# EAGLE design dual_encoder_i2c_revC (EAGLE 8.6.0)
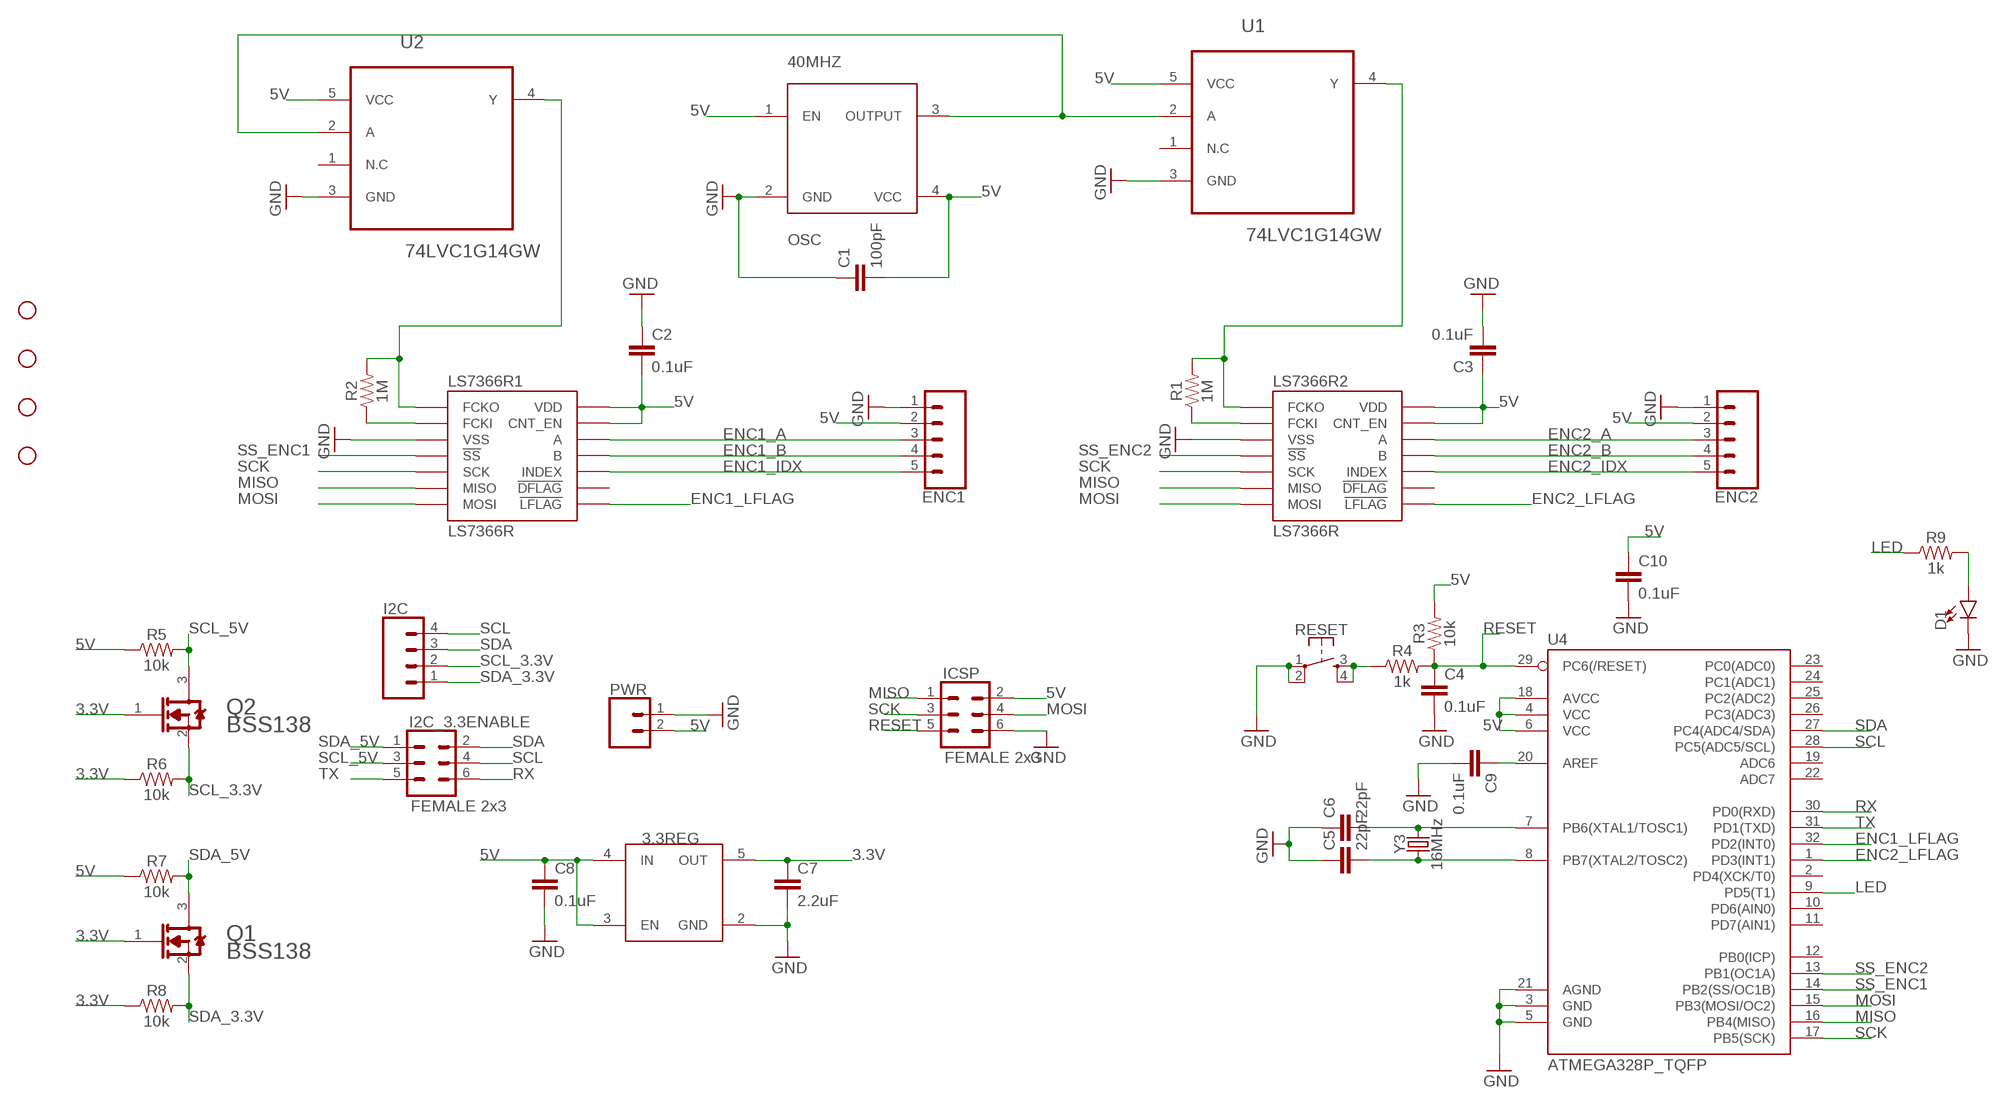
[diagram p0: schematic, sheet 1]

## Parts
3.3REG  MIC3490-3.3YM5-TR  [SOT95P285X145-5N]
40MHZ  OSC  [CB3OSCILLATOR]
C1  100pF  100PF-0603-50V-5%  [0603]
C2  0.1uF  0.1UF-0603-25V-5%  [0603]
C3  0.1uF  0.1UF-0603-25V-5%  [0603]
C4  0.1uF  0.1UF-0603-25V-5%  [0603]
C5  22pF  22PF-0603-50V-5%  [0603]
C6  22pF  22PF-0603-50V-5%  [0603]
C7  2.2uF  2.2UF-0603-10V-20%  [0603]
C8  0.1uF  0.1UF-0603-25V-5%  [0603]
C9  0.1uF  0.1UF-0603-25V-5%  [0603]
C10  0.1uF  0.1UF-0603-25V-5%  [0603]
D1  LED0603  [LED-0603]
ENC1  CONN_05  [1X05]
ENC2  CONN_05  [1X05]
H1  STAND-OFF  [STAND-OFF]
H2  STAND-OFF  [STAND-OFF]
H3  STAND-OFF  [STAND-OFF]
H4  STAND-OFF  [STAND-OFF]
I2C  CONN_04  [1X04]
I2C_3.3ENABLE  FEMALE 2x3  CONN_03X2FEMALE  [2X3]
ICSP  FEMALE 2x3  CONN_03X2FEMALE  [2X3]
LS7366R1  LS7366R  [SOIC14]
LS7366R2  LS7366R  [SOIC14]
PWR  CONN_02-JST-2MM-SMT  [JST-2-SMD]
Q1  ON_SEMI_BSS138ON_SEMI_BSS138_0_0  [ON_SEMI_BSS138_0]
Q2  ON_SEMI_BSS138ON_SEMI_BSS138_0_0  [ON_SEMI_BSS138_0]
R1  1M  1MOHM-0603-1/4W-5%  [0603]
R2  1M  1MOHM-0603-1/4W-5%  [0603]
R3  10k  10KOHM-0603-1/10W-1%  [0603]
R4  1k  1KOHM-0603-1/10W-1%  [0603]
R5  10k  10KOHM-0603-1/10W-1%  [0603]
R6  10k  10KOHM-0603-1/10W-1%  [0603]
R7  10k  10KOHM-0603-1/10W-1%  [0603]
R8  10k  10KOHM-0603-1/10W-1%  [0603]
R9  1k  1KOHM-0603-1/10W-1%  [0603]
RESET  MOMENTARY-SWITCH-SPST-2-SMD-5.2MM  [TACTILE_SWITCH_SMD_5.2MM]
U1  74LVC1G14GW  [SOT65P210X110-5N]
U2  74LVC1G14GW  [SOT65P210X110-5N]
U4  ATMEGA328P_TQFP  [TQFP32-08]
Y3  16MHz  CRYSTAL-16MHZSMD-5X3.2  [CRYSTAL-SMD-5X3.2-4PAD]

## Nets
3.3V: 3.3REG.5(OUT) C7.1 Q1.1(G) Q2.1(G) R6.1 R8.1
5V: 3.3REG.3(EN) 3.3REG.4(IN) 40MHZ.1(EN) 40MHZ.4(VCC) C1.2 C2.2 C3.1 C8.1 C10.1 ENC1.2 ENC2.2 ICSP.2 LS7366R1.13(CNT_EN) LS7366R1.14(VDD) LS7366R2.13(CNT_EN) LS7366R2.14(VDD) PWR.2 R3.2 R5.1 R7.1 U1.5(VCC) U2.5(VCC) U4.4(VCC) U4.6(VCC) U4.18(AVCC)
ENC1_A: ENC1.3 LS7366R1.12(A)
ENC1_B: ENC1.4 LS7366R1.11(B)
ENC1_IDX: ENC1.5 LS7366R1.10(INDEX)
ENC1_LFLAG: LS7366R1.8(!LFLAG) U4.32(PD2(INT0))
ENC2_A: ENC2.3 LS7366R2.12(A)
ENC2_B: ENC2.4 LS7366R2.11(B)
ENC2_IDX: ENC2.5 LS7366R2.10(INDEX)
ENC2_LFLAG: LS7366R2.8(!LFLAG) U4.1(PD3(INT1))
GND: 3.3REG.2(GND) 40MHZ.2(GND) C1.1 C2.1 C3.2 C4.2 C5.1 C6.1 C7.2 C8.2 C9.2 C10.2 D1.C ENC1.1 ENC2.1 ICSP.6 LS7366R1.3(VSS) LS7366R2.3(VSS) PWR.1 RESET.1 RESET.2 U1.3(GND) U2.3(GND) U4.3(GND) U4.5(GND) U4.21(AGND)
LED: R9.1 U4.9(PD5(T1))
MISO: ICSP.1 LS7366R1.6(MISO) LS7366R2.6(MISO) U4.16(PB4(MISO))
MOSI: ICSP.4 LS7366R1.7(MOSI) LS7366R2.7(MOSI) U4.15(PB3(MOSI/OC2))
N$1: C9.1 U4.20(AREF)
N$2: R4.1 RESET.3 RESET.4
N$3: D1.A R9.2
N$6: LS7366R1.2(FCKI) R2.1
N$7: 40MHZ.3(OUTPUT) U1.2(A) U2.2(A)
N$8: LS7366R2.1(FCKO) R1.2 U1.4(Y)
N$9: LS7366R2.2(FCKI) R1.1
N$10: LS7366R1.1(FCKO) R2.2 U2.4(Y)
N$12: C6.2 U4.7(PB6(XTAL1/TOSC1)) Y3.3
N$13: C5.2 U4.8(PB7(XTAL2/TOSC2)) Y3.1
RESET: C4.1 ICSP.5 R3.1 R4.2 U4.29(PC6(/RESET))
RX: I2C_3.3ENABLE.6 U4.30(PD0(RXD))
SCK: ICSP.3 LS7366R1.5(SCK) LS7366R2.5(SCK) U4.17(PB5(SCK))
SCL: I2C.4 I2C_3.3ENABLE.4 U4.28(PC5(ADC5/SCL))
SCL_3.3V: I2C.2 Q2.2(S) R6.2
SCL_5V: I2C_3.3ENABLE.3 Q2.3(D) R5.2
SDA: I2C.3 I2C_3.3ENABLE.2 U4.27(PC4(ADC4/SDA))
SDA_3.3V: I2C.1 Q1.2(S) R8.2
SDA_5V: I2C_3.3ENABLE.1 Q1.3(D) R7.2
SS_ENC1: LS7366R1.4(!SS) U4.14(PB2(SS/OC1B))
SS_ENC2: LS7366R2.4(!SS) U4.13(PB1(OC1A))
TX: I2C_3.3ENABLE.5 U4.31(PD1(TXD))
Unconnected: LS7366R1.9(!DFLAG) LS7366R2.9(!DFLAG) U1.1(N.C) U2.1(N.C) U4.2(PD4(XCK/T0)) U4.10(PD6(AIN0)) U4.11(PD7(AIN1)) U4.12(PB0(ICP)) U4.19(ADC6) U4.22(ADC7) U4.23(PC0(ADC0)) U4.24(PC1(ADC1)) U4.25(PC2(ADC2)) U4.26(PC3(ADC3))

## Library data of the parts
3.3REG = steveo:MIC3490-3.3YM5-TR
40MHZ = steveo:OSC: CB3 40mhz Oscillator smd
C1 = SparkFun-Capacitors:100PF: 100pF/0.1nF ceramic capacitors A capacitor is a passive two-terminal electrical component used to store electrical energy temporarily in an electric field.; PROD_ID: CAP-07883
C2-C4 C8-C10 = SparkFun-Capacitors:0.1UF: 0.1µF ceramic capacitors A capacitor is a passive two-terminal electrical component used to store electrical energy temporarily in an electric field.; PROD_ID: CAP-08604
C5 C6 = SparkFun-Capacitors:22PF: 22pF ceramic capacitors A capacitor is a passive two-terminal electrical component used to store electrical energy temporarily in an electric field.; PROD_ID: CAP-07876
C7 = SparkFun-Capacitors:2.2UF: 2.2µF ceramic capacitors A capacitor is a passive two-terminal electrical component used to store electrical energy temporarily in an electric field.; PROD_ID: CAP-07888
D1 = SparkFun-LED:LED: LED (Generic) Standard schematic elements and footprints for 5mm, 3mm, 1206, and 0603 sized LEDs. Generic LEDs with no color specified.
ENC1 ENC2 = SparkFun-Connectors:CONN_05: Multi connection point. Often used as Generic Header-pin footprint for 0.1 inch spaced/style header connections On any of the 0.1 inch spaced packages, you can populate with these: Break Away Headers - Straight <https://www.sparkfun.com/products/116> (PRT-00116) Break Away Male Headers - Right Angle <https://www.sparkfun.com/products/553> (PRT-00553) Female Headers <https://www.sparkfun.com/products/115> (PRT-00115) Break Away Headers - Machine Pin <https://www.sparkfun.com/products/117> (PRT-00117) Break Away Female Headers - Swiss Machine Pin <https://www.sparkfun.com/products/743> (PRT-00743) For SCREWTERMINALS and SPRING TERMINALS visit here: Screw Terimnals on SparkFun.com <https://www.sparkfun.com/search/results?term=Screw+Terminals> (5mm/3.5mm/2.54mm spacing) This device is also useful as a general connection point to wire up your design to another part of your project. Our various solder wires solder well into these plated through hole pads. Hook-Up Wire - Assortment (Stranded, 22 AWG) <https://www.sparkfun.com/products/11375> (PRT-11375) Hook-Up Wire - Assortment (Solid Core, 22 AWG) <https://www.sparkfun.com/products/11367> (PRT-11367) View the entire wire category on our website here <https://www.sparkfun.com/categories/141> Special notes: Molex polarized connector foot print use with SKU : PRT-08231 with associated crimp pins and housings. 1MM SMD Version SKU: PRT-10208
H1-H4 = SparkFun-Hardware:STAND-OFF: Stand Off Drill holes for mechanically mounting via screws, standoffs, etc. Note: Use the keepout ring to avoid running the screw head into surrounding components. Variant Overviews STAND-OFF - Mechanical footprint for a #4 phillips button head screw. STAND-OFF-TIGHT - Mechanical footprint for a #4 phillips button head screw, Example SparkFun Products Screw - Phillips Head (1/4", 4-40, 10 pack) <https://www.sparkfun.com/products/10453> (PRT-10453) Screw - Phillips Head (1/2", 4-40, 10 pack) <https://www.sparkfun.com/products/10452> (PRT-10452) Screw - Phillips Head (3/4", 4-40, 10 pack) <https://www.sparkfun.com/products/10451> (PRT-10451) Screw - Phillips Head (1", 4-40, 10 pack) <https://www.sparkfun.com/products/10450> (PRT-10450)
I2C = SparkFun-Connectors:CONN_04: Multi connection point. Often used as Generic Header-pin footprint for 0.1 inch spaced/style header connections On any of the 0.1 inch spaced packages, you can populate with these: Break Away Headers - Straight <https://www.sparkfun.com/products/116> (PRT-00116) Break Away Male Headers - Right Angle <https://www.sparkfun.com/products/553> (PRT-00553) Female Headers <https://www.sparkfun.com/products/115> (PRT-00115) Break Away Headers - Machine Pin <https://www.sparkfun.com/products/117> (PRT-00117) Break Away Female Headers - Swiss Machine Pin <https://www.sparkfun.com/products/743> (PRT-00743) For SCREWTERMINALS and SPRING TERMINALS visit here: Screw Terimnals on SparkFun.com <https://www.sparkfun.com/search/results?term=Screw+Terminals> (5mm/3.5mm/2.54mm spacing) This device is also useful as a general connection point to wire up your design to another part of your project. Our various solder wires solder well into these plated through hole pads. Hook-Up Wire - Assortment (Stranded, 22 AWG) <https://www.sparkfun.com/products/11375> (PRT-11375) Hook-Up Wire - Assortment (Solid Core, 22 AWG) <https://www.sparkfun.com/products/11367> (PRT-11367) View the entire wire category on our website here <https://www.sparkfun.com/categories/141> Special notes: Molex polarized connector foot print use with SKU : PRT-08231 with associated crimp pins and housings. 1MM SMD Version SKU: PRT-10208; PROD_ID: CONN-09696
I2C_3.3ENABLE ICSP = SparkFun-Connectors:CONN_03X2: Multi connection point. Often used as Generic Header-pin footprint for 0.1 inch spaced/style header connections You can populate with any combo of single row headers, but if you'd like an exact match, check these: Header - 2x3 (Male, 0.1") <https://www.sparkfun.com/products/12807> (PRT-12807) Header - 2x3 (Female, 0.1") <https://www.sparkfun.com/products/13010> (PRT-13010) 2x3 Pin Shrouded Header <https://www.sparkfun.com/products/10877> (PRT-10877) On any of the 0.1 inch spaced packages, you can populate with these: Break Away Headers - Straight <https://www.sparkfun.com/products/116> (PRT-00116) Break Away Male Headers - Right Angle <https://www.sparkfun.com/products/553> (PRT-00553) Female Headers <https://www.sparkfun.com/products/115> (PRT-00115) Break Away Headers - Machine Pin <https://www.sparkfun.com/products/117> (PRT-00117) Break Away Female Headers - Swiss Machine Pin <https://www.sparkfun.com/products/743> (PRT-00743) Special note: the shrouded connector mates well with our 3x2 ribbon cables: Ribbon Crimp Connector - 6-pin (2x3, Female) <https://www.sparkfun.com/products/10651> (PRT-10651) Ribbon Cable - 6 wire (15ft) <https://www.sparkfun.com/products/10646> (PRT-10646); PROD_ID: CONN-11566
LS7366R1 LS7366R2 = LS7366R:LS7366R; AVAILABILITY: Unavailable; MF: LSI; MP: LS7366R; PACKAGE: None; PRICE: None
PWR = SparkFun-Connectors:CONN_02: Multi connection point. Often used as Generic Header-pin footprint for 0.1 inch spaced/style header connections On any of the 0.1 inch spaced packages, you can populate with these: Break Away Headers - Straight <https://www.sparkfun.com/products/116> (PRT-00116) Break Away Male Headers - Right Angle <https://www.sparkfun.com/products/553> (PRT-00553) Female Headers <https://www.sparkfun.com/products/115> (PRT-00115) Break Away Headers - Machine Pin <https://www.sparkfun.com/products/117> (PRT-00117) Break Away Female Headers - Swiss Machine Pin <https://www.sparkfun.com/products/743> (PRT-00743) For SCREWTERMINALS and SPRING TERMINALS visit here: Screw Terimnals on SparkFun.com <https://www.sparkfun.com/search/results?term=Screw+Terminals> (5mm/3.5mm/2.54mm spacing) This device is also useful as a general connection point to wire up your design to another part of your project. Our various solder wires solder well into these plated through hole pads. Hook-Up Wire - Assortment (Stranded, 22 AWG) <https://www.sparkfun.com/products/11375> (PRT-11375) Hook-Up Wire - Assortment (Solid Core, 22 AWG) <https://www.sparkfun.com/products/11367> (PRT-11367) View the entire wire category on our website here <https://www.sparkfun.com/categories/141> Special notes: Molex polarized connector foot print use with: PRT-08233 with associated crimp pins and housings. 2.54_SCREWTERM for use with PRT-10571. 3.5mm Screw Terminal footprints for PRT-08084 5mm Screw Terminal footprints for use with PRT-08432; PROD_ID: CONN-11443
Q1 Q2 = ON Semi - BSS138:ON_SEMI_BSS138: N-Channel Logic Level Enhancement Mode Field Effect Transistor; CENTROID_NOT_SPECIFIED: No; DATASHEET: https://www.fairchildsemi.com/datasheets/BS/BSS138.pdf; DIGIKEY_DESCRIPTION: TRANS MOSFET N-CH 50V 220MA SOT-23; DIGIKEY_PART_NUMBER: BSS138CT-ND; LEAD_FREE: yes; MF: ON Semi; MFG_PACKAGE_IDENT: BSS138; MFG_PACKAGE_IDENT_DATE: 0; MFG_PACKAGE_IDENT_REV: 0; MOUSER_DESCRIPTION: MOSFET SOT-23 N-CH LOGIC; MOUSER_PART_NUMBER: 512-BSS138; MPN: BSS138; PACKAGE: SOT23; PREFIX: Q; ROHS: yes; TEMPERATURE_RANGE_HIGH: +150°C; TEMPERATURE_RANGE_LOW: -55°C
R1 R2 = SparkFun-Resistors:1MOHM: 1MΩ resistor A resistor is a passive two-terminal electrical component that implements electrical resistance as a circuit element. Resistors act to reduce current flow, and, at the same time, act to lower voltage levels within circuits. - Wikipedia; PROD_ID: RES-07868
R3 R5-R8 = SparkFun-Resistors:10KOHM: 10kΩ resistor A resistor is a passive two-terminal electrical component that implements electrical resistance as a circuit element. Resistors act to reduce current flow, and, at the same time, act to lower voltage levels within circuits. - Wikipedia; PROD_ID: RES-00824
R4 R9 = SparkFun-Resistors:1KOHM: 1kΩ resistor A resistor is a passive two-terminal electrical component that implements electrical resistance as a circuit element. Resistors act to reduce current flow, and, at the same time, act to lower voltage levels within circuits. - Wikipedia; PROD_ID: RES-07856
RESET = SparkFun-Switches:MOMENTARY-SWITCH-SPST-2: Momentary Switch (Pushbutton) - SPST - Two Circuits Normally-open (NO) SPST momentary switches (buttons, pushbuttons). Schematic symbol includes two switch circuits. Variants SMD-4.6MMX2.8MM - 4.60mm x 2.80mm Tactile Momentary Button Switch - Used on SparkFun SAMD21 Mini Breakout <https://www.sparkfun.com/products/13664> SMD-5.2MM - Mini Pushbutton Switch - SMD <https://www.sparkfun.com/products/8720> - Used on Arduino Pro Mini <https://www.sparkfun.com/products/11114>; PROD_ID: SWCH-08247; SF_SKU: COM-08720
U1 U2 = 74LVC1G14GW:74LVC1G14GW: Single Schmitt-trigger inverter; AVAILABILITY: Unavailable; DESCRIPTION: IC MOS 74LVC1G14/SO/74LVC1G14GW PHILIPS RoHS LVC SOt23; MF: NXP Semiconductors; MP: 74LVC1G14GW; PACKAGE: TSSOP-5 NXP Semiconductors; PRICE: 214.47 USD
U4 = SparkFun-IC-Microcontroller:ATMEGA328P_TQFP: Popular 328P in QFP Storefront component: ATmega328 - TQFP <https://www.sparkfun.com/products/13448> (COM-13448) Datasheet <http://www.sparkfun.com/datasheets/Components/SMD/ATMega328.pdf> SparkFun Products SparkFun RedBoard - Programmed with Arduino <https://www.sparkfun.com/products/12757> (DEV-12757) Arduino Pro Mini 328 - 5V/16MHz <https://www.sparkfun.com/products/11113> (DEV-11113) Arduino Pro Mini 328 - 3.3V/8MHz <https://www.sparkfun.com/products/11114> (DEV-11114) SparkFun OpenLog <https://www.sparkfun.com/products/13712> (DEV-13712) SparkFun MicroView - OLED Arduino Module <https://www.sparkfun.com/products/12923> (DEV-12923) SparkFun Digital Sandbox <https://www.sparkfun.com/products/12651> (DEV-12651) SparkFun PicoBoard <https://www.sparkfun.com/products/11888> (WIG-11888) Arduino Fio <https://www.sparkfun.com/products/10116> (DEV-10116) LilyPad Arduino 328 Main Board <https://www.sparkfun.com/products/13342> (DEV-13342) SparkFun RedStick <https://www.sparkfun.com/products/13741> (DEV-13741) LilyPad MP3 <https://www.sparkfun.com/products/11013> (DEV-11013) LilyPad Arduino SimpleSnap <https://www.sparkfun.com/products/10941> (DEV-10941) SparkFun Stepoko <https://www.sparkfun.com/products/13899> (ROB-13899) SparkFun Geiger Counter <https://www.sparkfun.com/products/11345> (SEN-11345) SparkFun EL Sequencer <https://www.sparkfun.com/products/12781> (COM-12781) Arduino Pro 328 - 5V/16MHz <https://www.sparkfun.com/products/10915> (DEV-10915) CryptoCape <https://www.sparkfun.com/products/12773> (DEV-12773) SparkFun IR Thermometer Evaluation Board - MLX90614 <https://www.sparkfun.com/products/10740> (SEN-10740) SparkFun RedBot Mainboard <https://www.sparkfun.com/products/12097> (ROB-12097) Arduino Pro 328 - 3.3V/8MHz <https://www.sparkfun.com/products/10914> (DEV-10914) SparkFun Block for Intel® Edison - Arduino <https://www.sparkfun.com/products/13036> (DEV-13036) SparkFun Simon Says - Surface Mount Soldering Kit <https://www.sparkfun.com/products/10935> (KIT-10935) SparkFun 7-Segment Serial Display - Red <https://www.sparkfun.com/products/11441> (COM-11441) SparkFun 7-Segment Serial Display - White <https://www.sparkfun.com/products/11629> (COM-11629) SparkFun 7-Segment Serial Display - Yellow <https://www.sparkfun.com/products/11443> (COM-11443) SparkFun 7-Segment Serial Display - Kelly Green <https://www.sparkfun.com/products/11440> (COM-11440) SparkFun 7-Segment Serial Display - Blue <https://www.sparkfun.com/products/11442> (COM-11442) SparkFun OpenSegment Serial Display - 20mm (Blue) <https://www.sparkfun.com/products/11647> (COM-11647) SparkFun OpenSegment Serial Display - 20mm (Green) <https://www.sparkfun.com/products/11646> (COM-11646) SparkFun OpenSegment Serial Display - 20mm (White) <https://www.sparkfun.com/products/11648> (COM-11648) SparkFun OpenSegment Serial Display - 20mm (Red) <https://www.sparkfun.com/products/11644> (COM-11644) SparkFun OpenSegment Serial Display - 20mm (Yellow) <https://www.sparkfun.com/products/11645> (COM-11645) SparkFun OpenSegment Shield <https://www.sparkfun.com/products/13190> (DEV-13190); PROD_ID: IC-09069
Y3 = SparkFun-Clocks:CRYSTAL-16MHZ: 16MHz Crystal Digikey Example <http://www.digikey.com/product-search/en?keywords=535-9122-1-ND> Frequency: 16MHz Frequency Stability: ±50ppm Frequency Tolerance: ±20ppm Load Capacitance: 18pF SparkFun Products: Pro Micro -5V/16MHz <https://www.sparkfun.com/products/12640> SparkFun Serial Enabled LCD Kit <https://www.sparkfun.com/products/10097>; PROD_ID: XTAL-08218; SF_ID: COM-00094

## Board
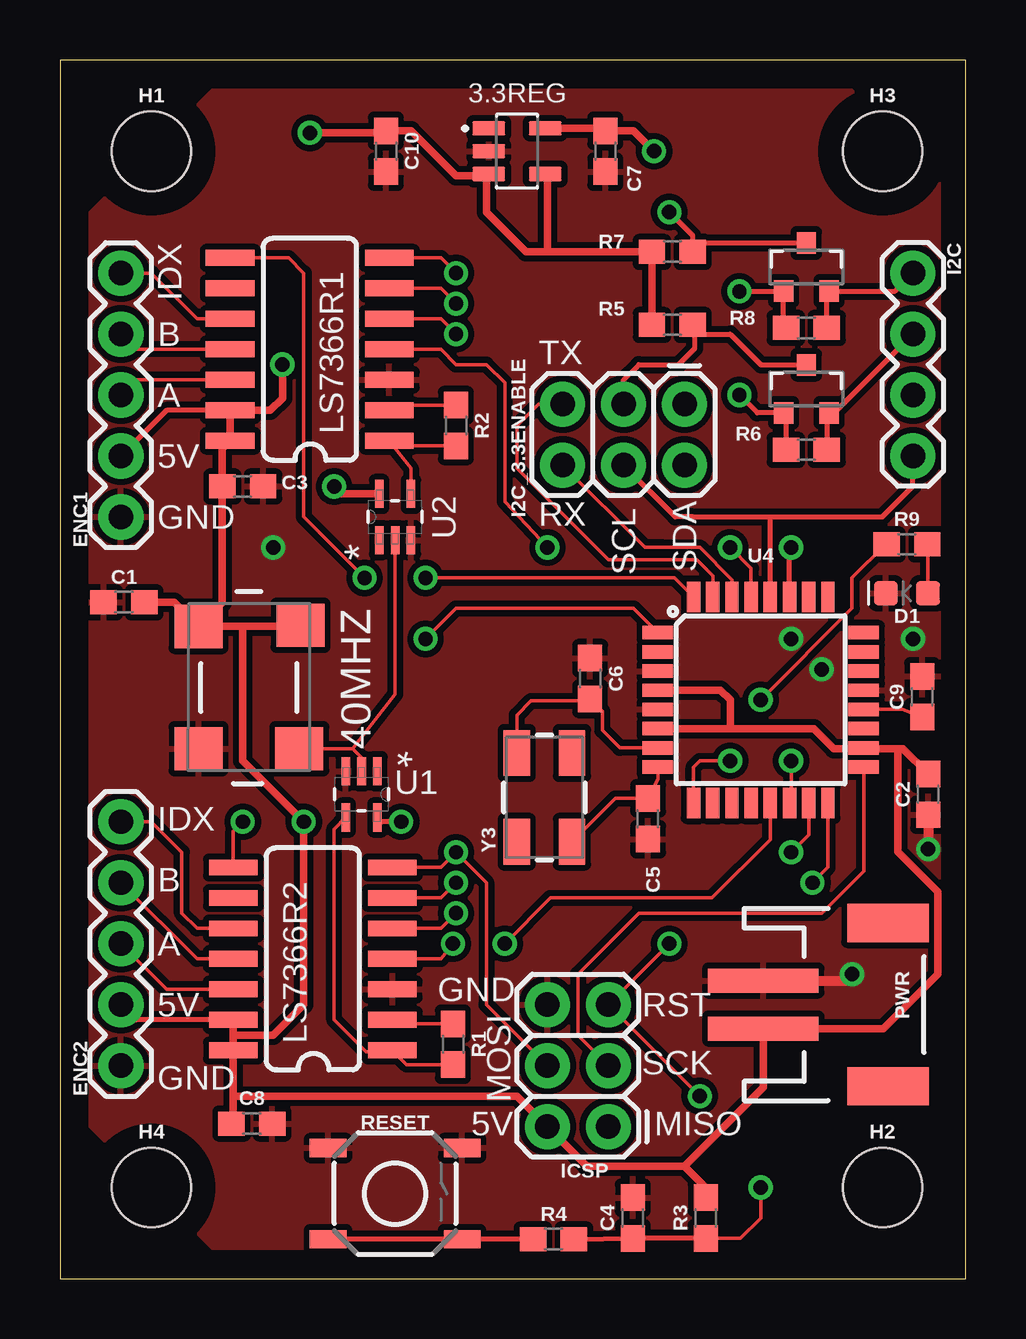
[diagram p1: board, top side]
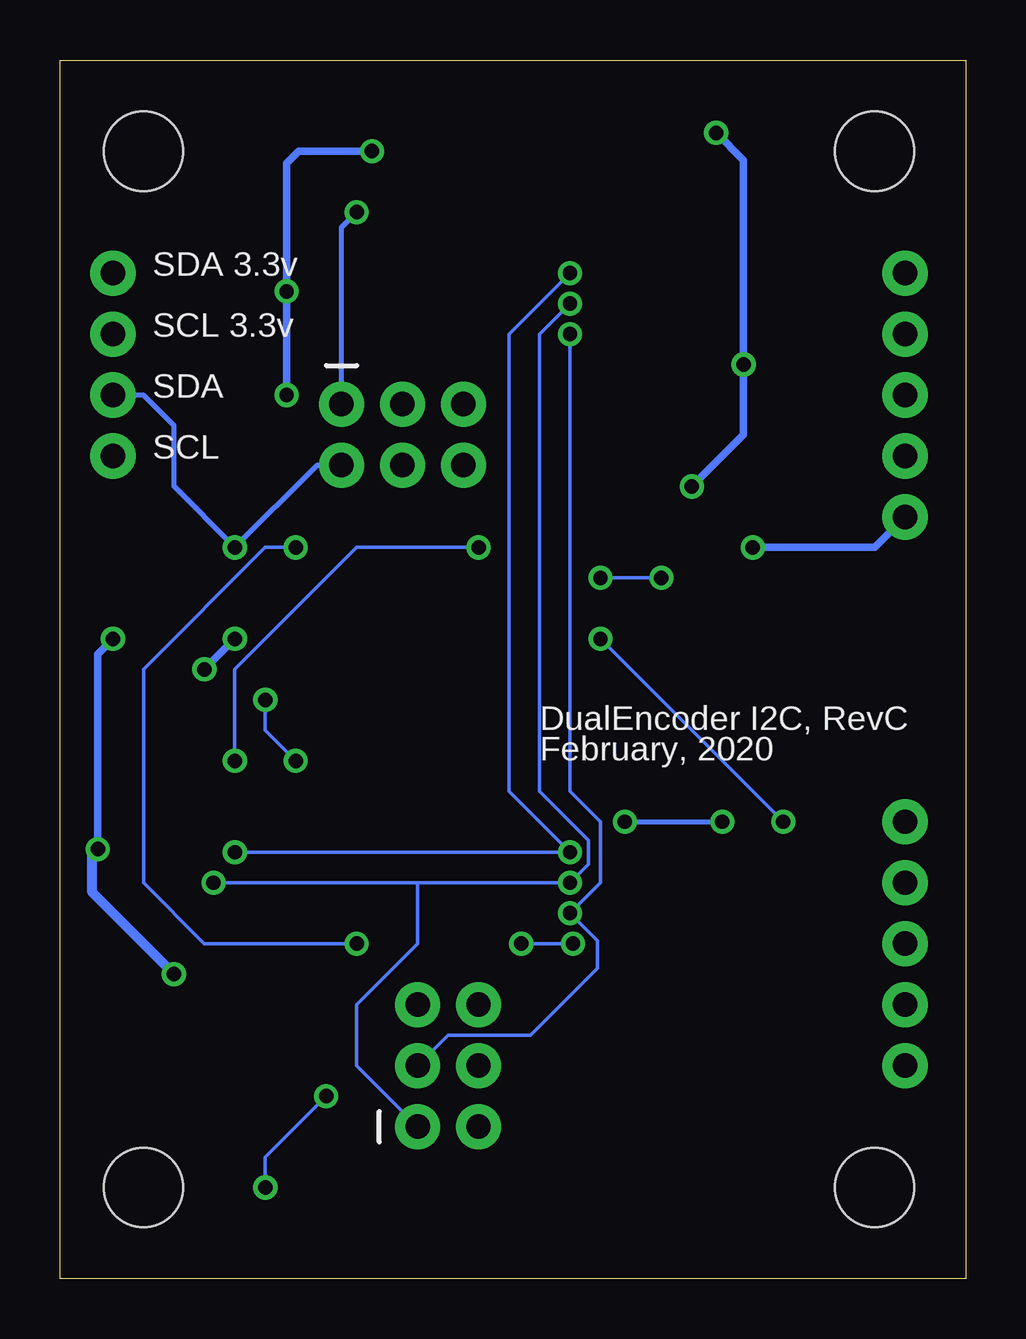
[diagram p2: board, bottom side, seen from below]

Size 37.77 x 50.79 mm. Coordinates in mm from the lower left corner, seen from the top.
Outline: 0,0 37.77,0 37.77,50.79 0,50.79 0,0
Copper layers (1*16): Top 0.035mm / dielectric 1.5mm / Bottom 0.035mm
Design rules "default": minimum track width 6mil, minimum drill 0.35mm, track to track 6mil, track to pad 6mil, pad to pad 6mil, via to via 6mil, smd to smd 6mil, copper to edge 40mil, drill to drill 6mil, minimum pad ring 10mil, minimum via ring 8mil, stop-mask expansion 4mil, vias tented up to drill 0mil, thermal gap 10mil

### Footprints (pad centres in the part's own frame; a part is rotated, then mirrored left to right if it is on the bottom)
SOT95P285X145-5N = smd 1.37 x 0.59: 1 -1.175,0.95; 2 -1.175,0; 3 -1.175,-0.95; 4 1.175,-0.95; 5 1.175,0.95
CB3OSCILLATOR = smd 1.8 x 2: 1 -2.55,-2.1; 2 2.55,-2.1; 3 2.55,2.1; 4 -2.6,2.15
0603 = smd 1.1 x 1: 1 -0.85,0; 2 0.85,0
LED-0603 = smd 1 x 1: A -0.877,0; C 0.877,0
1X05 = drill 1.016 pad 1.88: 1 0,0; 2 2.54,0; 3 5.08,0; 4 7.62,0; 5 10.16,0
STAND-OFF = hole 3.302: 0,0
1X04 = drill 1.016 pad 1.88: 1 0,0; 2 2.54,0; 3 5.08,0; 4 7.62,0
2X3 = drill 1.016 pad 1.88: 1 0,0; 2 0,2.54; 3 2.54,0; 4 2.54,2.54; 5 5.08,0; 6 5.08,2.54
SOIC14 = smd 2.032 x 0.66: 1 -3.315,4.445; 2 -3.315,3.175; 3 -3.315,1.905; 4 -3.315,0.635; 5 -3.315,-0.635; 6 -3.315,-1.905; 7 -3.315,-3.175; 8 3.315,-3.175; 9 3.315,-1.905; 10 3.315,-0.635; 11 3.315,0.635; 12 3.315,1.905; 13 3.315,3.175; 14 3.315,4.445
JST-2-SMD = smd 1 x 4.6: 1 -1,-3.7; 2 1,-3.7 | smd 1.6 x 3.4: NC1 -3.4,1.5; NC2 3.4,1.5
ON_SEMI_BSS138_0 = smd 0.8 x 0.9: 1 -0.95,-1; 2 0.95,-1; 3 0,1
TACTILE_SWITCH_SMD_5.2MM = smd 1.524 x 0.762: 1 -2.794,1.905; 2 2.794,1.905; 3 -2.794,-1.905; 4 2.794,-1.905
SOT65P210X110-5N = smd 1.168 x 0.356: 1 -0.965,0.66; 2 -0.965,0; 3 -0.965,-0.66; 4 0.965,-0.66; 5 0.965,0.66
TQFP32-08 = smd 1.27 x 0.559: 1 -4.293,2.8; 2 -4.293,2; 3 -4.293,1.2; 4 -4.293,0.4; 5 -4.293,-0.4; 6 -4.293,-1.2; 7 -4.293,-2; 8 -4.293,-2.8; 17 4.293,-2.8; 18 4.293,-2; 19 4.293,-1.2; 20 4.293,-0.4; 21 4.293,0.4; 22 4.293,1.2; 23 4.293,2; 24 4.293,2.8 | smd 0.559 x 1.27: 9 -2.8,-4.293; 10 -2,-4.293; 11 -1.2,-4.293; 12 -0.4,-4.293; 13 0.4,-4.293; 14 1.2,-4.293; 15 2,-4.293; 16 2.8,-4.293; 25 2.8,4.293; 26 2,4.293; 27 1.2,4.293; 28 0.4,4.293; 29 -0.4,4.293; 30 -1.2,4.293; 31 -2,4.293; 32 -2.8,4.293
CRYSTAL-SMD-5X3.2-4PAD = smd 1.9 x 1.1: 1 -1.85,-1.15; 2 1.85,-1.15; 3 1.85,1.15; 4 -1.85,1.15

### Placement (x,y rotation side)
3.3REG  19.05,46.99 0 top
40MHZ  7.87,24.64 270 top
C1  2.67,28.19 0 top
C2  36.2,20.19 90 top
C3  7.62,33.02 0 top
C4  23.88,2.54 90 top
C5  24.51,19.18 90 top
C6  22.1,25.02 270 top
C7  22.73,46.99 270 top
C8  8,6.48 0 top
C9  35.94,24.26 90 top
C10  13.59,46.99 270 top
D1  35.31,28.57 180 top
ENC1  2.54,31.75 90 top
ENC2  2.54,8.89 90 top
H1  3.81,46.99 0 top
H2  34.29,3.81 0 top
H3  34.29,46.99 0 top
H4  3.81,3.81 0 top
I2C  35.56,41.91 270 top
I2C_3.3ENABLE  26.04,36.45 180 top
ICSP  22.86,6.35 90 top
LS7366R1  10.41,39.37 180 top
LS7366R2  10.54,13.97 180 top
PWR  33.02,11.43 270 top
Q1  31.11,42.16 0 top
Q2  31.11,37.08 0 top
R1  16.38,9.78 270 top
R2  16.51,35.56 270 top
R3  26.92,2.54 90 top
R4  20.57,1.65 0 top
R5  25.53,39.75 0 top
R6  31.11,34.54 0 top
R7  25.53,42.8 0 top
R8  31.11,39.62 0 top
R9  35.31,30.61 0 top
RESET  13.97,3.56 0 top
U1  12.57,20.19 270 top
U2  13.97,31.75 90 top
U4  29.21,24.13 0 top
Y3  20.19,20.07 90 top

### Tracks (layer width: path | path; a pad name or v marks a point on that pad's centre or on a via)
3.3V  (via drill 0.6)
  Top 0.203: 22.76,47.94 C7.1 | R6.1 30.27,35.98 Q2.1 29.07,36.08 v28.32,36.83 | R8.1 30.16,39.72 Q1.1 30.15,41.15 v28.32,41.15
  Top 0.305: v24.77,46.99 23.91,47.84 C7.1 22.63,47.94 3.3REG.5
  Bottom 0.305: v24.77,46.99 27.81,46.99 28.32,46.48 v28.32,41.15 v28.32,36.83
5V  (via drill 0.6)
  Top 0.203: LS7366R2.13 3.17,10.79 ENC2.2 | LS7366R1.13 4.45,36.2 ENC1.2 | v14.22,19.05 13.41,19.05 U1.5
  Top 0.305: 40MHZ.1 7.62,27.19 | 7.62,27.19 9.97,27.19 40MHZ.4 | C1.2 4.77,28.19 40MHZ.1 | 40MHZ.1 6.77,28.18 C3.1 6.77,34.6 LS7366R1.14 LS7366R1.13 8.76,36.2 9.27,36.7 v9.27,38.1 | LS7366R2.13 7.23,10.16 | 7.23,10.16 LS7366R2.14 7.23,7.62 | 7.23,10.16 8.89,10.16 10.16,11.43 v10.16,19.05 7.62,21.59 7.62,27.19 | 26.04,4.7 21.97,4.7 ICSP.2 19.05,7.62 7.23,7.62 | 26.04,4.7 26.92,3.81 R3.2 | 26.04,4.7 29.32,7.98 PWR.2 34.33,10.43 36.6,12.7 36.6,16.13 34.92,17.81 34.92,22.1 | U4.6 27.94,22.93 | 27.94,22.93 31.43,22.93 32.26,22.1 33.47,22.1 | 33.47,22.1 U4.18 | U4.4 27.54,24.53 27.94,24.13 27.94,22.93 | 34.92,22.1 33.47,22.1 | v10.41,47.75 13.5,47.75 C10.1 14.64,47.84 16.51,45.97 17.81,45.97 3.3REG.3 17.78,45.95 17.78,44.45 19.43,42.8 20.32,42.8 | U2.5 11.73,32.72 v11.43,33.02 | 20.32,42.8 R7.1 R5.1 | C2.2 35.14,22.1 34.92,22.1 | 20.32,42.8 20.32,45.95 3.3REG.4 | 7.23,7.62 7.23,6.55 C8.1
  Bottom 0.203: v14.22,19.05 v10.16,19.05
  Bottom 0.305: v10.41,47.75 9.27,46.61 v9.27,38.1 9.27,35.18 v11.43,33.02
ENC1_A
  Top 0.152: LS7366R1.12 3.17,37.47 ENC1.3
ENC1_B
  Top 0.152: LS7366R1.11 3.17,38.73 ENC1.4
ENC1_IDX
  Top 0.152: LS7366R1.10 5.71,40.01 3.81,41.91 ENC1.5
ENC1_LFLAG  (via drill 0.6)
  Top 0.152: LS7366R1.8 9.53,42.55 10.16,41.91 10.16,31.75 v12.7,29.21 | U4.32 25.62,29.21 v15.24,29.21
  Bottom 0.152: v12.7,29.21 v15.24,29.21
ENC2_A
  Top 0.152: LS7366R2.12 4.45,12.06 ENC2.3
ENC2_B
  Top 0.152: LS7366R2.11 5.71,13.34 ENC2.4
ENC2_IDX
  Top 0.152: LS7366R2.10 5.71,14.61 5.08,15.24 5.08,17.78 3.81,19.05 ENC2.5
ENC2_LFLAG  (via drill 0.6)
  Top 0.152: LS7366R2.8 7.23,18.66 v7.62,19.05 | v15.24,26.67 16.51,27.94 23.91,27.94 U4.1
  Bottom 0.152: v7.62,19.05 v15.24,26.67
GND  (via drill 0.6)
  Top 0.406: PWR.1 32.75,12.43 v33.02,12.7 | C2.1 v36.2,17.91
  Bottom 0.305: ENC1.1 3.81,30.48 v8.89,30.48 | v36.2,17.91 36.2,26.04 v35.56,26.67 | v31.75,25.4 v30.48,26.67
  Bottom 0.406: v33.02,12.7 36.42,16.1 36.42,17.68 v36.2,17.91
  pour Top (isolate 0.254): 7.62,1.27 31.75,1.27 36.83,6.35 36.83,45.72 33.02,49.53 31.75,49.53 6.35,49.53 1.27,44.45 1.27,6.35 6.35,1.27
LED  (via drill 0.6)
  Top 0.152: U4.9 26.41,21.33 26.67,21.59 v27.94,21.59 | v29.21,24.13 33.02,27.94 33.02,29.21 34.42,30.61 R9.1
  Bottom 0.152: v27.94,21.59 29.21,22.86 v29.21,24.13
MISO  (via drill 0.6)
  Top 0.152: LS7366R2.6 15.88,15.88 v16.51,16.51 | LS7366R1.6 15.88,41.27 v16.51,40.64 | v31.37,16.51 32.01,17.15 U4.16
  Bottom 0.152: ICSP.1 25.4,8.89 25.4,11.43 22.86,13.97 22.86,16.51 | 22.86,16.51 v16.51,16.51 15.75,17.27 15.75,18.29 17.78,20.32 17.78,39.37 v16.51,40.64 | 22.86,16.51 v31.37,16.51
MOSI  (via drill 0.6)
  Top 0.152: LS7366R2.7 15.88,17.14 v16.51,17.78 17.78,16.51 17.78,11.43 ICSP.4 | LS7366R1.7 15.88,42.55 v16.51,41.91 | v30.48,17.78 31.21,18.51 U4.15
  Bottom 0.152: v30.48,17.78 v16.51,17.78 19.05,20.32 19.05,39.37 v16.51,41.91
N$1
  Top 0.152: U4.20 35.12,23.73 C9.1
N$2
  Top 0.203: R4.1 RESET.4 RESET.3
N$3
  Top 0.152: R9.2 36.18,30.58 D1.A
N$6
  Top 0.152: LS7366R1.2 13.94,36.41 R2.1
N$7
  Top 0.152: 40MHZ.3 12.2,22.09 | U2.2 13.97,24.36 12.2,22.09 | U1.2 12.57,21.72 12.2,22.09
N$8
  Top 0.152: R1.2 14.45,8.93 13.91,9.47 | 13.91,9.47 LS7366R2.1 | 13.91,9.47 12.76,9.47 11.43,10.79 11.43,18.75 U1.4
N$9
  Top 0.152: R1.1 14.02,10.63 LS7366R2.2
N$10
  Top 0.152: U2.4 14.63,33.77 LS7366R1.1 13.94,34.71 R2.2
N$12
  Top 0.152: 24.39,22.13 U4.7 23.34,22.13 22.61,22.86 22.61,23.66 22.18,24.09 | 22.18,24.09 C6.2 | Y3.3 19.04,23.49 19.64,24.09 22.18,24.09
N$13
  Top 0.152: 24.39,21.33 U4.8 24.92,20.81 C5.2 23.15,20.03 Y3.1
RESET  (via drill 0.6)
  Top 0.152: v25.4,13.97 ICSP.5 v26.67,7.62 | v29.21,3.81 29.21,2.54 28.36,1.69 26.67,1.69 | U4.29 28.81,29.61 v27.94,30.48
  Top 0.203: R4.2 C4.1 26.67,1.69 R3.1
  Bottom 0.152: v25.4,13.97 31.75,13.97 34.29,16.51 34.29,25.4 29.21,30.48 v27.94,30.48 | v26.67,7.62 29.21,5.08 v29.21,3.81
RX
  Top 0.152: U4.30 28.01,29.14 26.67,30.48 25.4,30.48 25.15,30.48 24.38,30.48 I2C_3.3ENABLE.6
SCK  (via drill 0.6)
  Top 0.152: LS7366R2.5 15.88,14.61 v16.51,15.24 | LS7366R1.5 15.88,40.01 v16.51,39.37 | U4.17 33.5,16.99 31.75,15.24 24.13,15.24 21.59,12.7 21.59,10.16 ICSP.3
  Bottom 0.152: v16.51,39.37 16.51,20.32 15.24,19.05 15.24,16.51 v16.51,15.24 15.37,14.1 15.37,12.95 18.16,10.16 21.59,10.16 ICSP.3
SCL
  Top 0.203: I2C.4 35.56,33.02 34.29,31.75 29.59,31.75 | 29.59,31.75 26.67,31.75 26.42,31.75 25.65,31.75 I2C_3.3ENABLE.4 | U4.28 29.61,31.73 29.59,31.75
SCL_3.3V
  Top 0.203: R6.2 31.96,35.98 Q2.2 32.27,36.08 I2C.2
SCL_5V
  Top 0.203: R5.2 26.46,39.67 | 26.46,39.67 26.76,39.37 27.94,39.37 29.23,38.08 Q2.3 | I2C_3.3ENABLE.3 23.5,37.47 24.13,38.1 25.78,38.1 26.46,38.78 26.46,39.67
SDA  (via drill 0.6)
  Top 0.203: U4.27 30.41,30.41 v30.48,30.48
  Bottom 0.203: I2C_3.3ENABLE.2 27.05,33.91 v30.48,30.48 33.02,33.02 33.02,35.56 34.29,36.83 I2C.3
SDA_3.3V
  Top 0.203: R8.2 31.96,41.06 Q1.2 34.81,41.16 I2C.1
SDA_5V  (via drill 0.6)
  Top 0.203: Q1.3 26.74,43.16 R7.2 26.38,43.47 v25.4,44.45
  Bottom 0.203: I2C_3.3ENABLE.1 26.04,43.81 v25.4,44.45
SS_ENC1  (via drill 0.6)
  Top 0.152: LS7366R1.4 15.88,38.73 16.51,38.1 17.78,38.1 18.54,37.34 18.54,32.38 v20.32,30.48 | U4.14 30.48,19.91 v30.48,21.59
  Bottom 0.152: v30.48,21.59 30.48,25.4 25.4,30.48 v20.32,30.48
SS_ENC2  (via drill 0.6)
  Top 0.152: LS7366R2.4 15.88,13.34 v16.38,13.97 | U4.13 29.61,18.31 27.18,15.88 20.45,15.88 v18.54,13.97
  Bottom 0.152: v16.38,13.97 v18.54,13.97
TX
  Top 0.152: U4.31 27.21,29.3 26.54,29.97 22.86,29.97 19.05,33.78 19.05,35.56 19.94,36.45 I2C_3.3ENABLE.5

### Text on the board
tPlace: IDX | B | TX | A | 5V | SCL | GND | RX | SDA | IDX | B | A | GND | 5V | RST | SCK | GND | MOSI | 5V | MISO
bPlace: SDA 3.3v | SCL 3.3v | SDA | SCL | DualEncoder I2C, RevC | February, 2020